# Altium schematic sheet mcu.SchDoc: <Project Name>
size A4; ENG_APP_DATE: --/--/--; DSN_APP_DATE: --/--/--; CHK_APP_DATE: --/--/--; Engineer: Engineer; Address4: Thành phố Hồ Chí Minh; DocumentNumber: 1; Revision: 1.0; SheetNumber: 1; SheetTotal: 1
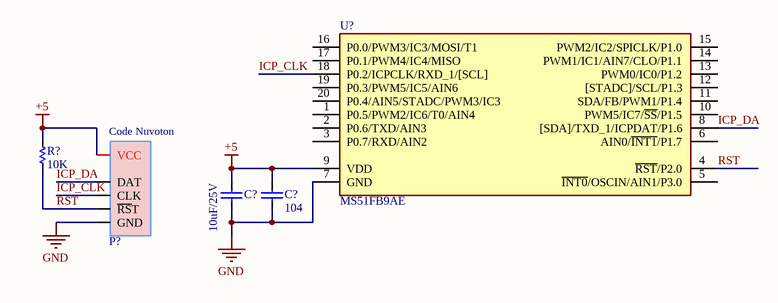
[diagram p0: mcu.SchDoc]

## Parts
(Parts that share a designator on the sheet are numbered #1, #2 ... from top to bottom, then left to right.)
C?#1  10uF/25V  [C_0805_SMD]
C?#2  104  [C_0805_SMD]
P?  Nuvoton  [Header Code Nuvoton 2.54 6P]  (value not drawn)  (no BOM)
R?  10K  [RES-SMD-0805]
U?  MS51FB9AE  [SOG65_20]

## Nets
+5: C?#1.1 C?#2.1 P?.1(VCC) R?.1 U?.9(VDD)
GND: C?#1.2 C?#2.2 P?.6(GND) U?.7(GND)
ICP_CLK: P?.4(CLK) U?.18(P0.2/ICPCLK/RXD_1/[SCL])
ICP_DA: P?.3(DAT) U?.8([SDA]/TXD_1/ICPDAT/P1.6)
RST: P?.5(~{RS}T) R?.2 U?.4(~{RST}/P2.0)

Not connected (* = marked no-connect by the designer): U? 1(P0.5/PWM2/IC6/T0/AIN4) 2(P0.6/TXD/AIN3) 3(P0.7/RXD/AIN2) 5(~{INT0}/OSCIN/AIN1/P3.0) 6(AIN0/~{INT1}/P1.7) 10(PWM5/IC7/~{SS}/P1.5) 11(SDA/FB/PWM1/P1.4) 12([STADC]/SCL/P1.3) 13(PWM0/IC0/P1.2) 14(PWM1/IC1/AIN7/CLO/P1.1) 15(PWM2/IC2/SPICLK/P1.0) 16(P0.0/PWM3/IC3/MOSI/T1) 17(P0.1/PWM4/IC4/MISO) 19(P0.3/PWM5/IC5/AIN6) 20(P0.4/AIN5/STADC/PWM3/IC3)

## Notes on the sheet
- Title
- Size:
- Date:
- A4
- Number:
- Time:
- Revision:
- Sheet
- of
- File:
- (in symbol Header Code Nuvoton) Code Nuvoton

## Library data of the parts
C?#1 = Cap 0805 10uF 25V: Cap SMD 0805 10uF; Code: 1436-100
C?#2 = Cap 0805 104 100nF: Cap SMD 0805 104-100nF-0.1uF 50V; Code: 1438-080
P? = Header Code Nuvoton: Header 6-5Pin
R? = Res 10k 0805: Resistor SMD 0805; Code: 1024-111
U? = MS51FB9AE: MS51FB9AE, ROM 16KB, RAM 256B + 1KB, SPROM 128B, 1T 8051-based CMOS up to 24Mhz; Code: 7201-019; Designed by: Nhox